# Altium schematic sheet Photoreciever.SchDoc
size A4
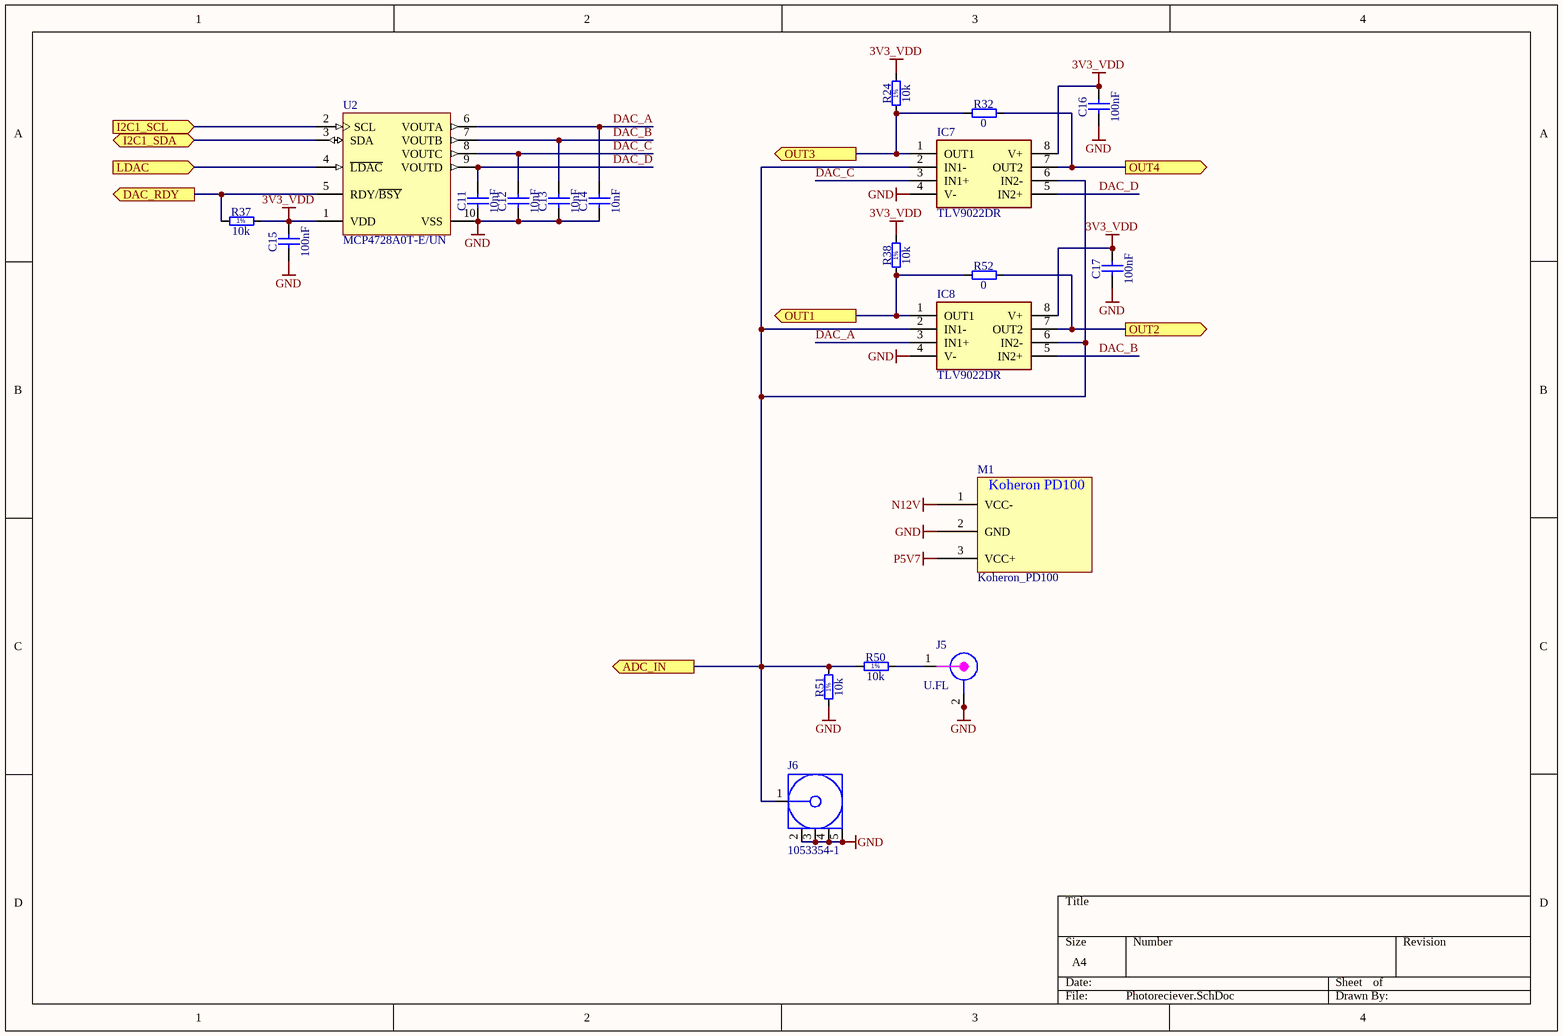
[diagram p0: Photoreciever.SchDoc]

## Parts
C11  10nF  [CAPC1005X55N]
C12  10nF  [CAPC1005X55N]
C13  10nF  [CAPC1005X55N]
C14  10nF  [CAPC1005X55N]
C15  100nF  [CAPC1005X55N]
C16  100nF  [CAPC1005X55N]
C17  100nF  [CAPC1005X55N]
IC7  TLV9022DR  [SOIC127P600X175-8N]
IC8  TLV9022DR  [SOIC127P600X175-8N]
J5  U.FL  [CON_UFL_HIROSE_RECEPTACLE]
J6  1053354-1  [TECO-1053354-1_V]
M1  Koheron_PD100  [Koheron_PD100]
R24  10k  [RESC1005X40N]
R32  0  [RESC1005X40N]
R37  10k  [RESC1005X40N]
R38  10k  [RESC1005X40N]
R50  10k  [RESC1005X40N]
R51  10k  [RESC1005X40N]
R52  0  [RESC1005X40N]
U2  MCP4728A0T-E/UN  [MSOP-UN10_M]

## Ports
ADC_IN (out), DAC_RDY (out), I2C1_SCL (in), I2C1_SDA (bidir), LDAC (in), OUT1 (out), OUT2 (out), OUT3 (out), OUT4 (out)

## Nets
3V3_VDD: C15.2 C16.2 C17.2 IC7.8(V+) IC8.8(V+) R24.2 R37.2 R38.2 U2.1(VDD)
GND: C11.1 C12.1 C13.1 C14.1 C15.1 C16.1 C17.1 IC7.4(V-) IC8.4(V-) J5.2 J5.2a(GND) J6.2 J6.3 J6.4 J6.5 M1.2(GND) R51.1 U2.10(VSS)
N12V: M1.1(VCC-)
P5V7: M1.3(VCC+)
ADC_IN: IC7.2(IN1-) IC7.6(IN2-) IC8.2(IN1-) IC8.6(IN2-) J6.1 R50.1 R51.2 ; port ADC_IN
DAC_A: C14.2 IC8.3(IN1+) U2.6(VOUTA)
DAC_B: C13.2 IC8.5(IN2+) U2.7(VOUTB)
DAC_C: C12.2 IC7.3(IN1+) U2.8(VOUTC)
DAC_D: C11.2 IC7.5(IN2+) U2.9(VOUTD)
DAC_RDY: R37.1 U2.5(RDY/~{BSY}) ; port DAC_RDY
I2C1_SCL: U2.2(SCL) ; port I2C1_SCL
I2C1_SDA: U2.3(SDA) ; port I2C1_SDA
LDAC: U2.4(~{LDAC}) ; port LDAC
OUT1: IC8.1(OUT1) R38.1 R52.1 ; port OUT1
OUT2: IC8.7(OUT2) R52.2 ; port OUT2
OUT3: IC7.1(OUT1) R24.1 R32.1 ; port OUT3
OUT4: IC7.7(OUT2) R32.2 ; port OUT4
NetJ5_1: J5.1 R50.2

## Notes on the sheet
- (in symbol Koheron_PD100) Koheron PD100
- (in symbol R0402_10K_1%_0.0625W_100PPM) 1%

## Library data of the parts
C11-C14 = CC0402_10NF_16V_10%_X7R: Non-polarised capacitor; Part Description: SMD Multilayer Chip Ceramic Capacitor; Manufacturer: GENERIC; Manufacturer1 Part Number: 223878715636; Voltage: 16V; TC: X7R; Tolerance: ±10%; Part Number: CC0402_10NF_16V_10%_X7R; Component Kind: Standard; Component Type: Standard; Pin Count: 2; Value: 10nF; Status: Not Recommended; Manufacturer Part Number: CC0402_10NF_16V_10%_X7R; Case: 0402; Mounted: Yes; Socket: No; SMD: Yes; Sense: No; Manufacturer1 Example: PHYCOMP; Manufacturer1 ComponentHeight: 0.55mm; HelpURL: \\cern.ch\dfs\Applications\Altium\Datasheets\CC0402_X7R_PHYCOMP.pdf; Author: CERN DEM JLC; CreateDate: 03.12.2007; LatestRevisionDate: 03.12.2007
C15-C17 = CC0402_100NF_16V_10%_X7R: Non-polarised capacitor; Part Description: SMD Multilayer Chip Ceramic Capacitor; Manufacturer: GENERIC; Manufacturer1 Part Number: GRM155R71C104KA88D; Voltage: 16V; TC: X7R; Tolerance: ±10%; Part Number: CC0402_100NF_16V_10%_X7R; Component Kind: Standard; Component Type: Standard; Pin Count: 2; Value: 100nF; Status: Not Recommended; Manufacturer Part Number: CC0402_100NF_16V_10%_X7R; Case: 0402; Mounted: Yes; Socket: No; SMD: Yes; Sense: No; Manufacturer1 Example: MURATA; Manufacturer1 ComponentHeight: 0.55mm; HelpURL: \\cern.ch\dfs\Applications\Altium\Datasheets\CC0402_X7R_MURATA_GRM.pdf; Author: CERN DEM JLC; CreateDate: 05.12.2013; LatestRevisionDate: 03.12.2007
IC7 IC8 = TLV9022DR: Integrated Circuit; Manufacturer_Name: Texas Instruments; Datasheet Link: https://www.arrow.com/en/products/tlv9022dr/texas-instruments; Height: 1.75mm; Manufacturer_Part_Number: TLV9022DR
J5 = CON_UFL_SMD: UFL; Supplier 1: Newark; Supplier Part Number 1: 50P8856
J6 = CMP-2000-05830-1: Female Coaxial Connector, Pitch 2.55 mm, Height 9.5 mm, Tail Length 3.9 mm, RoHS, Bulk; Manufacturer: TE Connectivity; Dynamic Catalog: SMA; Impedance: 50Ohm; Contact Termination: Solder; Connector Type: Jack,FemaleSockets; 3D Model: 1053354-1.pdf; Other Names: 2062000000 / A30046; Datasheet Version: Rev. B, 05/2011; Package Reference: 1053354-1; RoHS Information: 1053354-1StatementofCompliance; Series: SMA; Connector Style: SMA; Family: CoaxialConnectors(RF); Category: Connectors,Interconnects; Fastening Type: Threaded; Standard Package: 125; Mounting Type: ThroughHole; Packaging: Bulk; Datasheet URL: http://www.te.com/commerce/DocumentDelivery/DDEController?Action=srchrtrv&DocNm=1053354&DocType=Customer+Drawing&DocLang=English; Mounting Technology: ThroughHole; Manufacturer URL: http://www.te.com/; Package Description: Female Coaxial Connector, Pitch 2.55 mm, Height 9.5 mm, Tail Length 3.9 mm
R24 R37 R38 R50 R51 = R0402_10K_1%_0.0625W_100PPM: Resistor - 1%; Part Description: General Purpose Thick Film Chip Resistor; Manufacturer: GENERIC; Manufacturer1 Part Number: 232270671003L; TC: ±100ppm/°C; PressFit: No; Part Number: R0402_10K_1%_0.0625W_100PPM; Component Kind: Standard; Component Type: Standard; Pin Count: 2; Value: 10k; Status: Not Recommended; Power: 0.0625W; Tolerance: ±1%; Manufacturer Part Number: R0402_10K_1%_0.0625W_100PPM; Case: 0402; Mounted: Yes; Sense: No; Socket: No; SMD: Yes; Manufacturer1 Example: YAGEO PHYCOMP; Manufacturer1 ComponentHeight: 0.4mm; HelpURL: \\cern.ch\dfs\Applications\Altium\Datasheets\R0402_Phycomp_RC0402.pdf; Author: CERN DEM JLC; CreateDate: 03.12.2007; LatestRevisionDate: 17.10.2012
R32 R52 = R0402_0R_JUMPER: Resistor; Part Description: 1A (0.05R Max DC Resistance) Zero Ohm Jumper; Manufacturer: GENERIC; Manufacturer1 Part Number: 232270591001L; PressFit: No; Part Number: R0402_0R_JUMPER; Component Kind: Standard; Component Type: Standard; Pin Count: 2; Value: 0; Status: Not Recommended; Manufacturer Part Number: R0402_0R_JUMPER; Case: 0402; Mounted: Yes; Sense: No; Socket: No; SMD: Yes; Manufacturer1 Example: YAGEO PHYCOMP; Manufacturer1 ComponentHeight: 0.4mm; HelpURL: \\cern.ch\dfs\Applications\Altium\Datasheets\R0402_Phycomp_RC0402.pdf; Author: CERN DEM JLC; CreateDate: 03.12.2007; LatestRevisionDate: 17.10.2012
U2 = CMP-0188-01370-1: 12-Bit Quad Digital-to-Analog Converter with EEPROM Memory, 10-Pin MSOP, Extended Temperature, Tape and Reel; DatasheetVersion: revE, Oct-2010; ComponentLink2Description: Datasheet; ComponentLink2URL: http://ww1.microchip.com/downloads/en/DeviceDoc/22187E.pdf; PackageReference: MSOP-UN10; PackageDescription: 10-Lead Plastic Micro Small Outline Package (UN) [MSOP]; ComponentLink1Description: Manufacturer URL; PackageVersion: revBB, Aug-2009; ComponentLink3URL: http://www.microchip.com/stellent/groups/techpub_sg/documents/packagingspec/en012702.pdf; ComponentLink3Description: Package Specification; ComponentLink1URL: http://www.microchip.com/